# Altium schematic sheet Sheet2.SchDoc
size A4; SheetNumber: 2; SheetTotal: 2
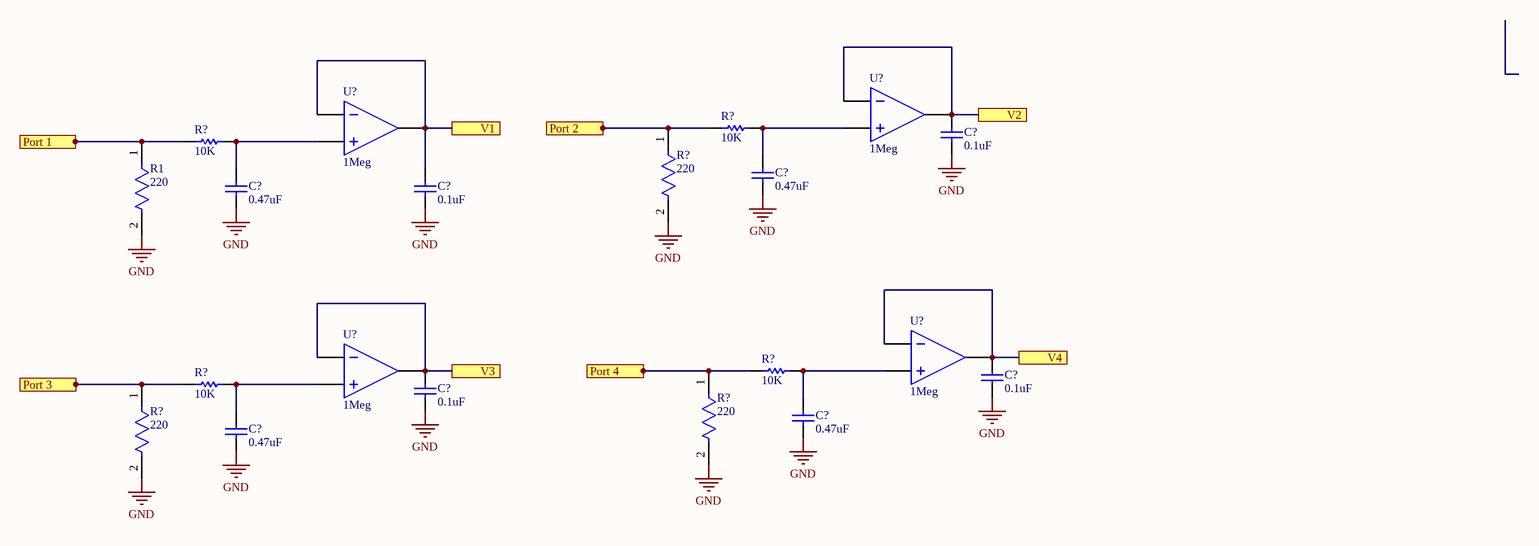
[diagram p0: Sheet2.SchDoc]

## Parts
(Parts that share a designator on the sheet are numbered #1, #2 ... from top to bottom, then left to right.)
C?#1  value 0.1uF  (hidden comment: Capacitor)
C?#2  value 0.47uF  (hidden comment: Capacitor)
C?#3  value 0.47uF  (hidden comment: Capacitor)
C?#4  value 0.1uF  (hidden comment: Capacitor)
C?#5  value 0.1uF  (hidden comment: Capacitor)
C?#6  value 0.1uF  (hidden comment: Capacitor)
C?#7  value 0.47uF  (hidden comment: Capacitor)
C?#8  value 0.47uF  (hidden comment: Capacitor)
R1  220  [FP-CRCW0603-e3-MFG]
R?#1  220  [FP-CRCW0603-e3-MFG]
R?#2  value 10K  (hidden comment: Resistor)
R?#3  value 10K  (hidden comment: Resistor)
R?#4  220  [FP-CRCW0603-e3-MFG]
R?#5  value 10K  (hidden comment: Resistor)
R?#6  220  [FP-CRCW0603-e3-MFG]
R?#7  value 10K  (hidden comment: Resistor)
U?#1  GAIN: 1Meg  (hidden comment: Ideal Operational Amplifier)
U?#2  GAIN: 1Meg  (hidden comment: Ideal Operational Amplifier)
U?#3  GAIN: 1Meg  (hidden comment: Ideal Operational Amplifier)
U?#4  GAIN: 1Meg  (hidden comment: Ideal Operational Amplifier)

## Ports
Port 1, Port 2, Port 3, Port 4, V1, V2, V3, V4

## Nets
GND: C?#1.1 C?#2.1 C?#3.1 C?#4.1 C?#5.1 C?#6.1 C?#7.1 C?#8.1 R1.2 R?#1.2 R?#4.2 R?#6.2
Port 1: R1.1 R?#3.1 ; port Port 1
Port 2: R?#1.1 R?#2.1 ; port Port 2
Port 3: R?#6.1 R?#7.1 ; port Port 3
Port 4: R?#4.1 R?#5.1 ; port Port 4
V1: C?#4.2 U?#2.1(IN-) U?#2.3(OUT) ; port V1
V2: C?#1.2 U?#1.1(IN-) U?#1.3(OUT) ; port V2
V3: C?#6.2 U?#4.1(IN-) U?#4.3(OUT) ; port V3
V4: C?#5.2 U?#3.1(IN-) U?#3.3(OUT) ; port V4
NetC?#2_2: C?#2.2 R?#2.2 U?#1.2(IN+)
NetC?#3_2: C?#3.2 R?#3.2 U?#2.2(IN+)
NetC?#7_2: C?#7.2 R?#5.2 U?#3.2(IN+)
NetC?#8_2: C?#8.2 R?#7.2 U?#4.2(IN+)

## Library data of the parts
C?#1-C?#8 = Capacitor: SimulationGenericComponent: True
R1 R?#1 R?#4 R?#6 = CMP-2000-03085-2: RES Thick Film, 220Ω, 1%, 0.1W, 100ppm/°C, 0603; Power Rating: 100mW; Voltage Rating: 75V; Resistance: 220R; Contact Plating: Tin; Package Quantity: 10; Lead Free: Lead Free; Packaging: Tape and Reel; Max Operating Temperature: 155°C; Case/Package: 0603; Radiation Hardening: No; Height: 0.45mm; Width: 0.033inch; Case Code (Imperial): 0603; Number of Terminations: 2; Tolerance: 1%; Min Operating Temperature: -55°C; Termination: SMD/SMT; Length: 1.55mm; Features: Automotive AEC-Q200; Voltage Rating (DC): 75V; Case Code (Metric): 1608; Composition: Thick Film; Military Standard: Not; Temperature Coefficient: 100ppm/°C; Depth: 0.85mm; Weight: 7.1E-05oz; Max Power Dissipation: 100mW
R?#2 R?#3 R?#5 R?#7 = Resistor: TC1: 0; SimulationGenericComponent: True; TC2: 0
U?#1-U?#4 = OpAmp: SimulationGenericComponent: True